# Altium schematic sheet Sheet1.SchDoc
size A; SheetNumber: 1; SheetTotal: 1
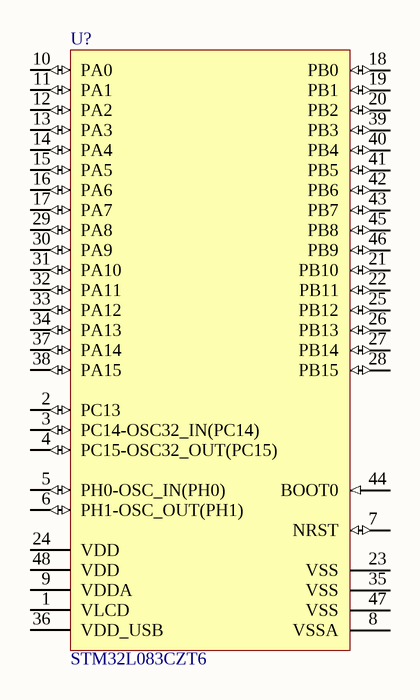
[diagram p0: Sheet1.SchDoc]

## Parts
U?  STM32L083CZT6  [STM-LQFP48_M]

## Nets

Not connected (* = marked no-connect by the designer): U? 1(VLCD) 2(PC13) 3(PC14-OSC32_IN(PC14)) 4(PC15-OSC32_OUT(PC15)) 5(PH0-OSC_IN(PH0)) 6(PH1-OSC_OUT(PH1)) 7(NRST) 8(VSSA) 9(VDDA) 10(PA0) 11(PA1) 12(PA2) 13(PA3) 14(PA4) 15(PA5) 16(PA6) 17(PA7) 18(PB0) 19(PB1) 20(PB2) 21(PB10) 22(PB11) 23(VSS) 24(VDD) 25(PB12) 26(PB13) 27(PB14) 28(PB15) 29(PA8) 30(PA9) 31(PA10) 32(PA11) 33(PA12) 34(PA13) 35(VSS) 36(VDD_USB) 37(PA14) 38(PA15) 39(PB3) 40(PB4) 41(PB5) 42(PB6) 43(PB7) 44(BOOT0) 45(PB8) 46(PB9) 47(VSS) 48(VDD)

## Library data of the parts
U? = CMP-1546-00074-1: Ultra-Low-Power ARM Cortex-M0+ MCU, 192 KB Flash, 20 KB Internal RAM, 40 I/Os, 48-Pin LQFP, -40 to 85 degC, Tray; Data E2PROM nom (B): 6144; Operating Frequency(F) (Processor speed) (MHz): 32; I/Os (High Current): 40; Supply Voltage(Vcc) min (V): 1.8; D/A Converter: 2; FLASH Size (Prog) (kB): 192; Internal RAM Size (kB): 20; Package Reference: LQFP48; ComponentLink1Description: Manufacturer URL; ComponentLink2URL: http://www.st.com/st-web-ui/static/active/en/resource/technical/document/datasheet/DM00140762.pdf; ComponentLink2Description: Datasheet; Mounting Technology: Surface Mount; Core: ARM Cortex-M0+; DatasheetVersion: Rev. 2; Packing: Tray; ComponentLink1URL: http://www.st.com/; Package Description: 48-Pin Low Profile Quad Flat Package, Body 7 x 7 mm, Pitch 0.5 mm